# Altium schematic sheet MCB1313epf.SchDoc
size A4
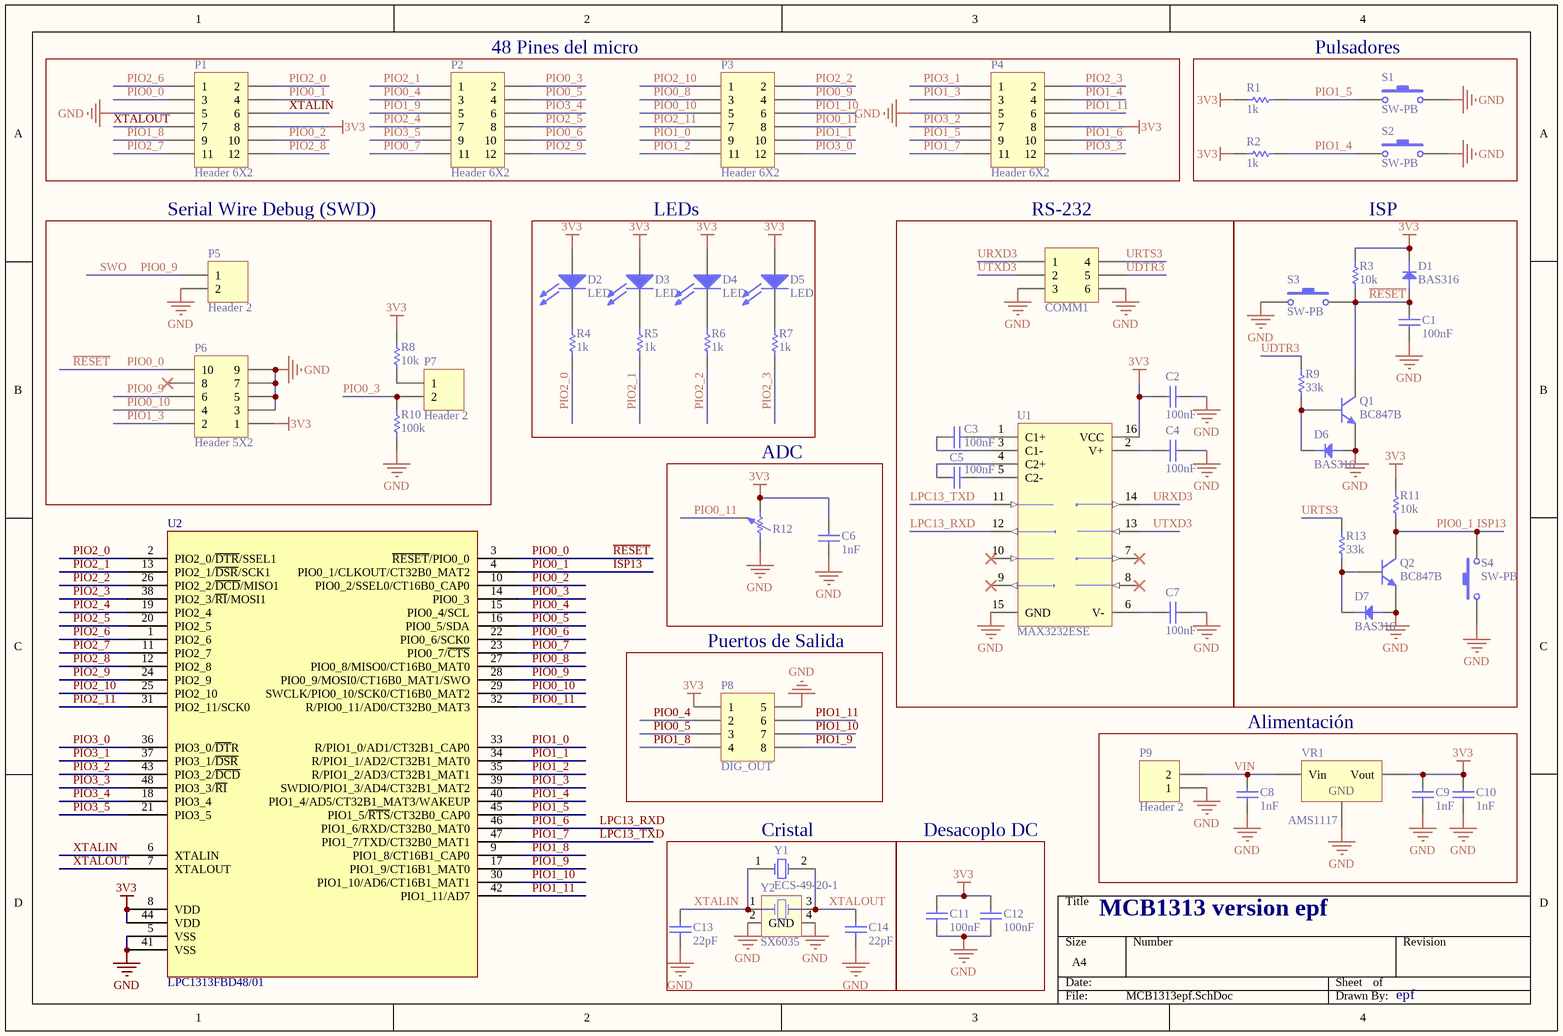
[diagram p0: MCB1313epf.SchDoc]

## Parts
C1  value 100nF  [0805_CAP]  (hidden comment: Capacitor)
C2  value 100nF  [0805_CAP]  (hidden comment: Capacitor)
C3  value 100nF  [0805_CAP]  (hidden comment: Capacitor)
C4  value 100nF  [0805_CAP]  (hidden comment: Capacitor)
C5  value 100nF  [0805_CAP]  (hidden comment: Capacitor)
C6  value 1nF  [0805_CAP]  (hidden comment: Capacitor)
C7  value 100nF  [0805_CAP]  (hidden comment: Capacitor)
C8  value 1nF  [0805_CAP]  (hidden comment: Capacitor)
C9  value 1nF  [0805_CAP]  (hidden comment: Capacitor)
C10  value 1nF  [0805_CAP]  (hidden comment: Capacitor)
C11  value 100nF  [0805_CAP]  (hidden comment: Capacitor)
C12  value 100nF  [0805_CAP]  (hidden comment: Capacitor)
C13  value 22pF  [0805_CAP]  (hidden comment: Capacitor)
C14  value 22pF  [0805_CAP]  (hidden comment: Capacitor)
COMM1  AP_COMM  [HDR2X3_CEN]  (value not drawn)
D1  BAS316  [SOD-323]
D2  LED  [LED0603]
D3  LED  [LED0603]
D4  LED  [LED0603]
D5  LED  [LED0603]
D6  BAS316  [SOD-323]
D7  BAS316  [SOD-323]
P1  Header 6X2  [HDR2X6]
P2  Header 6X2  [HDR2X6]
P3  Header 6X2  [HDR2X6]
P4  Header 6X2  [HDR2X6]
P5  Header 2  [HDR1X2]
P6  Header 5X2  [HDR2X5]
P7  Header 2  [HDR1X2]
P8  DIG_OUT  [HDR2X4_CEN]
P9  Header 2  [HDR1X2]
Q1  BC847B  [SOT23]
Q2  BC847B  [SOT23]
R1  value 1k  [0805_RES]  (hidden comment: Resistor)
R2  value 1k  [0805_RES]  (hidden comment: Resistor)
R3  value 10k  [0805_RES]  (hidden comment: Resistor)
R4  value 1k  [0805_RES]  (hidden comment: Resistor)
R5  value 1k  [0805_RES]  (hidden comment: Resistor)
R6  value 1k  [0805_RES]  (hidden comment: Resistor)
R7  value 1k  [0805_RES]  (hidden comment: Resistor)
R8  value 10k  [0805_RES]  (hidden comment: Resistor)
R9  value 33k  [0805_RES]  (hidden comment: Resistor)
R10  value 100k  [0805_RES]  (hidden comment: Resistor)
R11  value 10k  [0805_RES]  (hidden comment: Resistor)
R12  Pot  [POT_SMD]  (value not drawn)
R13  value 33k  [0805_RES]  (hidden comment: Resistor)
S1  SW-PB  [SW-PB6mm - 2]
S2  SW-PB  [SW-PB6mm - 2]
S3  SW-PB  [SW-PB6mm - 2]
S4  SW-PB  [SW-PB6mm - 2]
U1  MAX3232ESE  [SOIC127P602-16BN]
U2  LPC1313FBD48/01  [TQFP48_LPC1343]
VR1  AMS1117  [SOT-223 - M3]
Y1  ECS-49-20-1  [HC-49U]
Y2  SX6035  [SX6035]

## Blocks framed on the sheet
48 Pines del micro: P1-P4
Pulsadores: R1 R2 S1 S2
Serial Wire Debug (SWD): P5-P7 R8 R10
LEDs: D2-D5 R4-R7
RS-232: C2-C5 C7 COMM1 U1
ISP: C1 D1 D6 D7 Q1 Q2 R3 R9 R11 R13 S3 S4
ADC: C6 R12
Puertos de Salida: P8
Alimentación: C8-C10 P9 VR1
Cristal: C13 C14 Y1 Y2
Desacoplo DC: C11 C12

## Nets
3V3: C2.2 C6.2 C9.2 C10.2 C11.2 C12.2 D1.1(K) D2.1(A) D3.1(A) D4.1(A) D5.1(A) P1.8 P4.8 P6.1 P8.1 R1.1 R2.1 R3.2 R8.1 R11.2 R12.2 U1.16(VCC) U2.8(VDD) U2.44(VDD) VR1.2(Vout)
GND: C1.2 C2.1 C4.1 C6.1 C7.1 C8.1 C9.1 C10.1 C11.1 C12.1 C13.1 C14.2 COMM1.3 COMM1.6 D6.2(A) D7.2(A) P1.5 P4.5 P5.2 P6.3 P6.5 P6.7 P6.9 P8.5 P9.1 Q1.2(E) Q2.2(E) R10.2 R12.1 S1.2 S2.2 S3.1 S4.1 U1.15(GND) U2.5(VSS) U2.41(VSS) VR1.1(GND) Y2.2(GND) Y2.4(GND)
~{RESET}: C1.1 D1.2(A) P1.3 P6.10 Q1.3(C) R3.1 S3.2 U2.3(~{RESET}/PIO0_0)  [also labelled PIO0_0]
ISP13: P1.4 Q2.3(C) R11.1 S4.2 U2.4(PIO0_1/CLKOUT/CT32B0_MAT2)  [also labelled PIO0_1]
LPC13_RXD: P4.10 U1.12(R1OUT) U2.46(PIO1_6/RXD/CT32B0_MAT0)  [also labelled PIO1_6]
LPC13_TXD: P4.11 U1.11(T1IN) U2.47(PIO1_7/TXD/CT32B0_MAT1)  [also labelled PIO1_7]
PIO0_2: P1.10 U2.10(PIO0_2/SSEL0/CT16B0_CAP0)
PIO0_3: P2.2 P7.2 R10.1 U2.14(PIO0_3)
PIO0_4: P2.3 P8.2 U2.15(PIO0_4/SCL)
PIO0_5: P2.4 P8.3 U2.16(PIO0_5/SDA)
PIO0_6: P2.10 U2.22(PIO0_6/SCK0)
PIO0_7: P2.11 U2.23(PIO0_7/~{CTS})
PIO0_8: P3.3 U2.27(PIO0_8/MISO0/CT16B0_MAT0)
PIO0_9: P3.4 P5.1 P6.6 U2.28(PIO0_9/MOSI0/CT16B0_MAT1/SWO)  [also labelled SWO]
PIO0_10: P3.5 P6.4 U2.29(SWCLK/PIO0_10/SCK0/CT16B0_MAT2)
PIO0_11: P3.8 R12.3 U2.32(R/PIO0_11/AD0/CT32B0_MAT3)
PIO1_0: P3.9 U2.33(R/PIO1_0/AD1/CT32B1_CAP0)
PIO1_1: P3.10 U2.34(R/PIO1_1/AD2/CT32B1_MAT0)
PIO1_2: P3.11 U2.35(R/PIO1_2/AD3/CT32B1_MAT1)
PIO1_3: P4.3 P6.2 U2.39(SWDIO/PIO1_3/AD4/CT32B1_MAT2)
PIO1_4: P4.4 R2.2 S2.1 U2.40(PIO1_4/AD5/CT32B1_MAT3/WAKEUP)
PIO1_5: P4.9 R1.2 S1.1 U2.45(PIO1_5/~{RTS}/CT32B0_CAP0)
PIO1_8: P1.9 P8.4 U2.9(PIO1_8/CT16B1_CAP0)
PIO1_9: P2.5 P8.8 U2.17(PIO1_9/CT16B1_MAT0)
PIO1_10: P3.6 P8.7 U2.30(PIO1_10/AD6/CT16B1_MAT1)
PIO1_11: P4.6 P8.6 U2.42(PIO1_11/AD7)
PIO2_0: P1.2 R4.2 U2.2(PIO2_0/~{DTR}/SSEL1)
PIO2_1: P2.1 R5.2 U2.13(PIO2_1/~{DSR}/SCK1)
PIO2_2: P3.2 R6.2 U2.26(PIO2_2/~{DCD}/MISO1)
PIO2_3: P4.2 R7.2 U2.38(PIO2_3/~{RI}/MOSI1)
PIO2_4: P2.7 U2.19(PIO2_4)
PIO2_5: P2.8 U2.20(PIO2_5)
PIO2_6: P1.1 U2.1(PIO2_6)
PIO2_7: P1.11 U2.11(PIO2_7)
PIO2_8: P1.12 U2.12(PIO2_8)
PIO2_9: P2.12 U2.24(PIO2_9)
PIO2_10: P3.1 U2.25(PIO2_10)
PIO2_11: P3.7 U2.31(PIO2_11/SCK0)
PIO3_0: P3.12 U2.36(PIO3_0/~{DT}R)
PIO3_1: P4.1 U2.37(PIO3_1/~{DSR})
PIO3_2: P4.7 U2.43(PIO3_2/~{DCD})
PIO3_3: P4.12 U2.48(PIO3_3/~{RI})
PIO3_4: P2.6 U2.18(PIO3_4)
PIO3_5: P2.9 U2.21(PIO3_5)
UDTR3: COMM1.5 R9.2
URTS3: COMM1.4 R13.2
URXD3: COMM1.1 U1.14(T1OUT)
UTXD3: COMM1.2 U1.13(R1IN)
VIN: C8.2 P9.2 VR1.3(Vin)
XTALIN: C13.2 P1.6 U2.6(XTALIN) Y1.1(OSC1) Y2.1(XTAL)
XTALOUT: C14.1 P1.7 U2.7(XTALOUT) Y1.2(OSC2) Y2.3(XTAL)
NetC3_1: C3.1 U1.1(C1+)
NetC3_2: C3.2 U1.3(C1-)
NetC4_2: C4.2 U1.2(V+)
NetC5_1: C5.1 U1.5(C2-)
NetC5_2: C5.2 U1.4(C2+)
NetC7_2: C7.2 U1.6(V-)
NetD2_2: D2.2(K) R4.1
NetD3_2: D3.2(K) R5.1
NetD4_2: D4.2(K) R6.1
NetD5_2: D5.2(K) R7.1
NetD6_1: D6.1(K) Q1.1(B) R9.1
NetD7_1: D7.1(K) Q2.1(B) R13.1
NetP7_1: P7.1 R8.2

Not connected (* = marked no-connect by the designer): P6 8*; U1 7(T2OUT)* 8(R2IN)* 9(R2OUT)* 10(T2IN)*

## Notes on the sheet
- MCB1313 version epf
- epf

## Library data of the parts
C1-C14 = Cap
COMM1 = AP_COMM: Header, 3-Pin, Dual row; LatestRevisionDate: 17-Jul-2002; LatestRevisionNote: Re-released for DXP Platform.; Publisher: Altium Limited
D2-D5 = LED1
P1-P4 = Header 6X2: Header, 6-Pin, Dual row; LatestRevisionDate: 17-Jul-2002; LatestRevisionNote: Re-released for DXP Platform.; Publisher: Altium Limited
P5 P7 P9 = Header 2: Header, 2-Pin; LatestRevisionDate: 17-Jul-2002; LatestRevisionNote: Re-released for DXP Platform.; Publisher: Altium Limited
P6 = Header 5X2: Header, 5-Pin, Dual row; LatestRevisionDate: 17-Jul-2002; LatestRevisionNote: Re-released for DXP Platform.; Publisher: Altium Limited
P8 = AP_SALIDA_DIGITAL: Header, 4-Pin, Dual row; LatestRevisionDate: 17-Jul-2002; LatestRevisionNote: Re-released for DXP Platform.; Publisher: Altium Limited
Q1 Q2 = BC847B: NPN 100MHz
R1-R11 R13 = Res
S1-S4 = SW-PB: Switch; Published: 24-Mar-1999; LatestRevisionDate: 17-Jul-2002; LatestRevisionNote: Re-released for DXP Platform.; PackageReference: SPST-2; Publisher: Altium Limited
U1 = MAX3232ESE+
U2 = LPC1313FBD48/01: ARM CortexM3 32K Flash, 8k RAM
VR1 = AMS1117: Voltage Regulator; Published: 24-Mar-1999; LatestRevisionDate: 29-May-2009; LatestRevisionNote: IPC-7351 Footprint Added.; PackageReference: D2PAK; Publisher: Altium Limited; PackageDescription: 3-Pin Transistor Outline Package 2.54 mm Pitch, 15.1 mm Lead Span
Y1 = ECS-49-20-1: Crystal Oscillator; Published: 17-Jul-2002; DatasheetDocument: 18-Apr-2000; PackageReference: HC-49U; Publisher: Altium Limited; ComponentLink1Description: Manufacturer Link; ComponentLink1URL: http://www.ecsxtal.com/; ComponentLink2Description: Datasheet; ComponentLink2URL: http://www.ecsxtal.com/pdf2/HC49U.PDF
Y2 = XTAL_SX6035